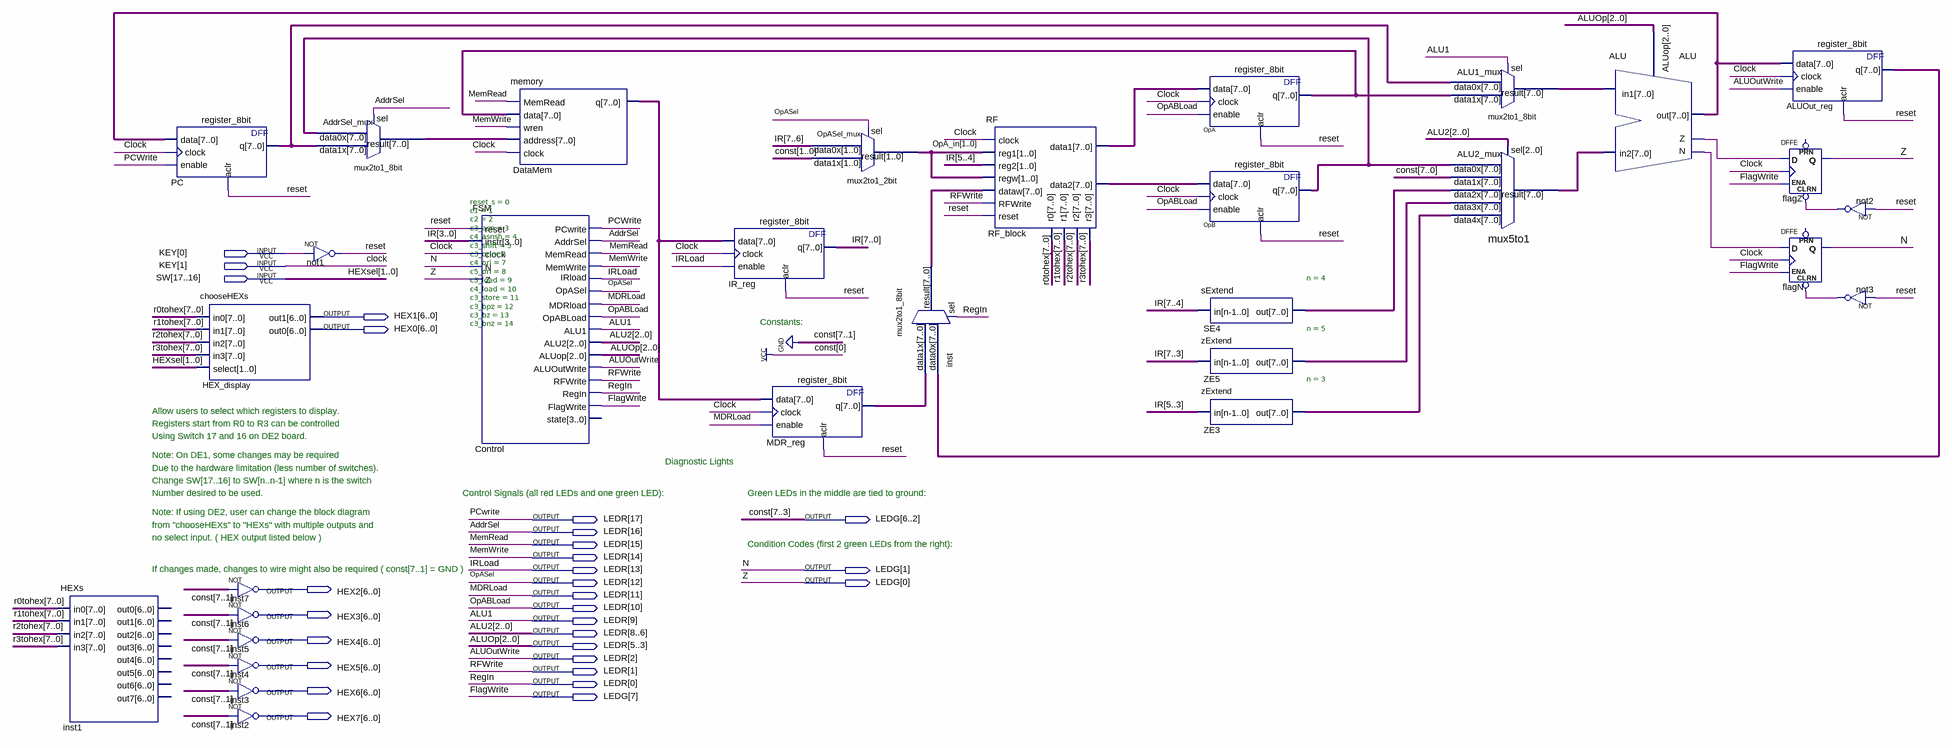
[diagram p0: schematic sheet]
// Quartus schematic multicycle.bdf as structural Verilog: 31 symbols, 29 pins
module multicycle (
  input  [1:0] KEY,
  input  [17:16] SW,
  output [6:0] HEX1,
  output [6:0] HEX0,
  output [17:0] LEDR,
  output [7:0] LEDG,
  output [6:0] HEX2,
  output [6:0] HEX3,
  output [6:0] HEX4,
  output [6:0] HEX5,
  output [6:0] HEX6,
  output [6:0] HEX7
);

  wire ALU_n, ALU_z, not2_out, not3_out, reset;
  wire [1:0] OpA_in;
  wire [7:0] AddrSel_mux_result, ALU1_mux_result, ALU2_mux_result, ALU_out, ALUOut, DataMem_q, inst_result,
       IR, MDR_reg_q, OpA_q, OpB_q, PC_q, r0tohex, r1tohex, r2tohex, r3tohex, RF_block_data1, RF_block_data2,
       SE4_out, ZE3_out, ZE5_out;

  HEXs inst1 (
    .in0(r0tohex), .in1(r1tohex), .in2(r2tohex), .in3(r3tohex));  // open: out0, out1, out2, out3, out4, out5, out6, out7
  register_8bit PC (.data(ALU_out), .clock(KEY[1]), .enable(LEDR[17]), .aclr(reset), .q(PC_q));
  chooseHEXs HEX_display (
    .in0(r0tohex), .in1(r1tohex), .in2(r2tohex), .in3(r3tohex), .select(SW), .out1(HEX1), .out0(HEX0));
  assign HEX2 = ~{7{1'b0}};  // NOT inst7, 7 bits wide
  assign HEX3 = ~{7{1'b0}};  // NOT inst6, 7 bits wide
  assign HEX4 = ~{7{1'b0}};  // NOT inst5, 7 bits wide
  assign HEX5 = ~{7{1'b0}};  // NOT inst4, 7 bits wide
  assign HEX6 = ~{7{1'b0}};  // NOT inst3, 7 bits wide
  assign HEX7 = ~{7{1'b0}};  // NOT inst2, 7 bits wide
  mux2to1_8bit AddrSel_mux (.data1x(PC_q), .data0x(OpB_q), .sel(LEDR[16]), .result(AddrSel_mux_result));
  not not1 (reset, KEY[0]);
  FSM #(.reset_s(0), .c1(1), .c2(2), .c3_asn(3), .c4_asnsh(4), .c3_shift(5), .c3_ori(6), .c4_ori(7), .c5_ori(8), .c3_load(9), .c4_load(10), .c3_store(11), .c3_bpz(12), .c3_bz(13), .c3_bnz(14)) Control (
    .reset(reset), .instr(IR[3:0]), .clock(KEY[1]), .N(LEDG[1]), .Z(LEDG[0]), .PCwrite(LEDR[17]),
    .AddrSel(LEDR[16]), .MemRead(LEDR[15]), .MemWrite(LEDR[14]), .IRload(LEDR[13]), .MDRload(LEDR[11]),
    .ALU1(LEDR[9]), .ALU2(LEDR[8:6]), .ALUop(LEDR[5:3]), .ALUOutWrite(LEDR[2]), .RFWrite(LEDR[1]),
    .RegIn(LEDR[0]), .FlagWrite(LEDG[7]), .OpABLoad(LEDR[10]), .OpASel(LEDR[12]));  // open: state
  memory DataMem (
    .MemRead(LEDR[15]), .data(OpA_q), .wren(LEDR[14]), .address(AddrSel_mux_result), .clock(KEY[1]),
    .q(DataMem_q));
  register_8bit IR_reg (.data(DataMem_q), .clock(KEY[1]), .enable(LEDR[13]), .aclr(reset), .q(IR));
  register_8bit MDR_reg (.data(DataMem_q), .clock(KEY[1]), .enable(LEDR[11]), .aclr(reset), .q(MDR_reg_q));
  mux2to1_2bit OpASel_mux (.data1x(2'b01), .data0x(IR[7:6]), .sel(LEDR[12]), .result(OpA_in));
  mux2to1_8bit inst (.data1x(MDR_reg_q), .data0x(ALUOut), .sel(LEDR[0]), .result(inst_result));
  RF RF_block (
    .clock(KEY[1]), .reg1(OpA_in), .reg2(IR[5:4]), .regw(OpA_in), .dataw(inst_result), .RFWrite(LEDR[1]),
    .reset(reset), .data1(RF_block_data1), .data2(RF_block_data2), .r0(r0tohex), .r1(r1tohex), .r2(r2tohex),
    .r3(r3tohex));
  register_8bit OpA (.data(RF_block_data1), .clock(KEY[1]), .enable(LEDR[10]), .aclr(reset), .q(OpA_q));
  register_8bit OpB (.data(RF_block_data2), .clock(KEY[1]), .enable(LEDR[10]), .aclr(reset), .q(OpB_q));
  sExtend #(.n(4)) SE4 (.in(IR[7:4]), .out(SE4_out));
  zExtend #(.n(5)) ZE5 (.in(IR[7:3]), .out(ZE5_out));
  zExtend #(.n(3)) ZE3 (.in(IR[5:3]), .out(ZE3_out));
  mux2to1_8bit ALU1_mux (.data1x(OpA_q), .data0x(PC_q), .sel(LEDR[9]), .result(ALU1_mux_result));
  mux5to1 ALU2_mux (
    .data4x(ZE3_out), .data3x(ZE5_out), .data2x(SE4_out), .data1x(8'b00000001), .data0x(OpB_q),
    .sel(LEDR[8:6]), .result(ALU2_mux_result));
  ALU ALU (.in1(ALU1_mux_result), .in2(ALU2_mux_result), .ALUop(LEDR[5:3]), .N(ALU_n), .Z(ALU_z), .out(ALU_out));
  register_8bit ALUOut_reg (.data(ALU_out), .clock(KEY[1]), .enable(LEDR[2]), .aclr(reset), .q(ALUOut));
  DFFE flagZ (.CLRN(not2_out), .D(ALU_z), .CLK(KEY[1]), .ENA(LEDG[7]), .Q(LEDG[0]));  // open: PRN
  DFFE flagN (.CLRN(not3_out), .D(ALU_n), .CLK(KEY[1]), .ENA(LEDG[7]), .Q(LEDG[1]));  // open: PRN
  not not2 (not2_out, reset);
  not not3 (not3_out, reset);

  assign LEDG[6:2] = {5{1'b0}};

  // Other names for the same wires on the sheet: AddrSel = LEDR[16]; ALU1 = LEDR[9]; ALU2[2:0] = LEDR[8:6];
  //   ALUOp[2:0] = LEDR[5:3]; ALUOutWrite = LEDR[2]; Clock = KEY[1]; FlagWrite = LEDG[7]; HEXsel[1:0] = SW;
  //   IRLoad = LEDR[13]; MDRLoad = LEDR[11]; MemRead = LEDR[15]; MemWrite = LEDR[14]; N = LEDG[1];
  //   OpABLoad = LEDR[10]; OpASel = LEDR[12]; PCWrite = LEDR[17]; RegIn = LEDR[0]; RFWrite = LEDR[1]; Z = LEDG[0]

  // Notes on the sheet:
  //   Constants:
  //   Allow users to select which registers to display.
  //   Registers start from R0 to R3 can be controlled
  //   Using Switch 17 and 16 on DE2 board.
  //   Note: On DE1, some changes may be required
  //   Diagnostic Lights
  //   Due to the hardware limitation (less number of switches).
  //   Change SW[17..16] to SW[n..n-1] where n is the switch
  //   Number desired to be used.
  //   Control Signals (all red LEDs and one green LED):
  //   Green LEDs in the middle are tied to ground:
  //   Note: If using DE2, user can change the block diagram
  //   from "chooseHEXs" to "HEXs" with multiple outputs and
  //   no select input. ( HEX output listed below )
  //   Condition Codes (first 2 green LEDs from the right):
  //   If changes made, changes to wire might also be required ( const[7..1] = GND )
endmodule
